# Altium schematic sheet EVK-NORA-W1_SCHEM_0005_Interface_Isolation.SchDoc
size B; Date: 7/24/2020; CompanyName: U-blox; DrawnBy: EMOO; Engineer: EMOO; Organization: U-blox; Address1: 3950 Fairview Industrial Dr SE #100*; Address2: Salem, OR 97302; SheetNumber: 4; SheetTotal: 6; SheetSize: B; SheetTitle: Interface MCU
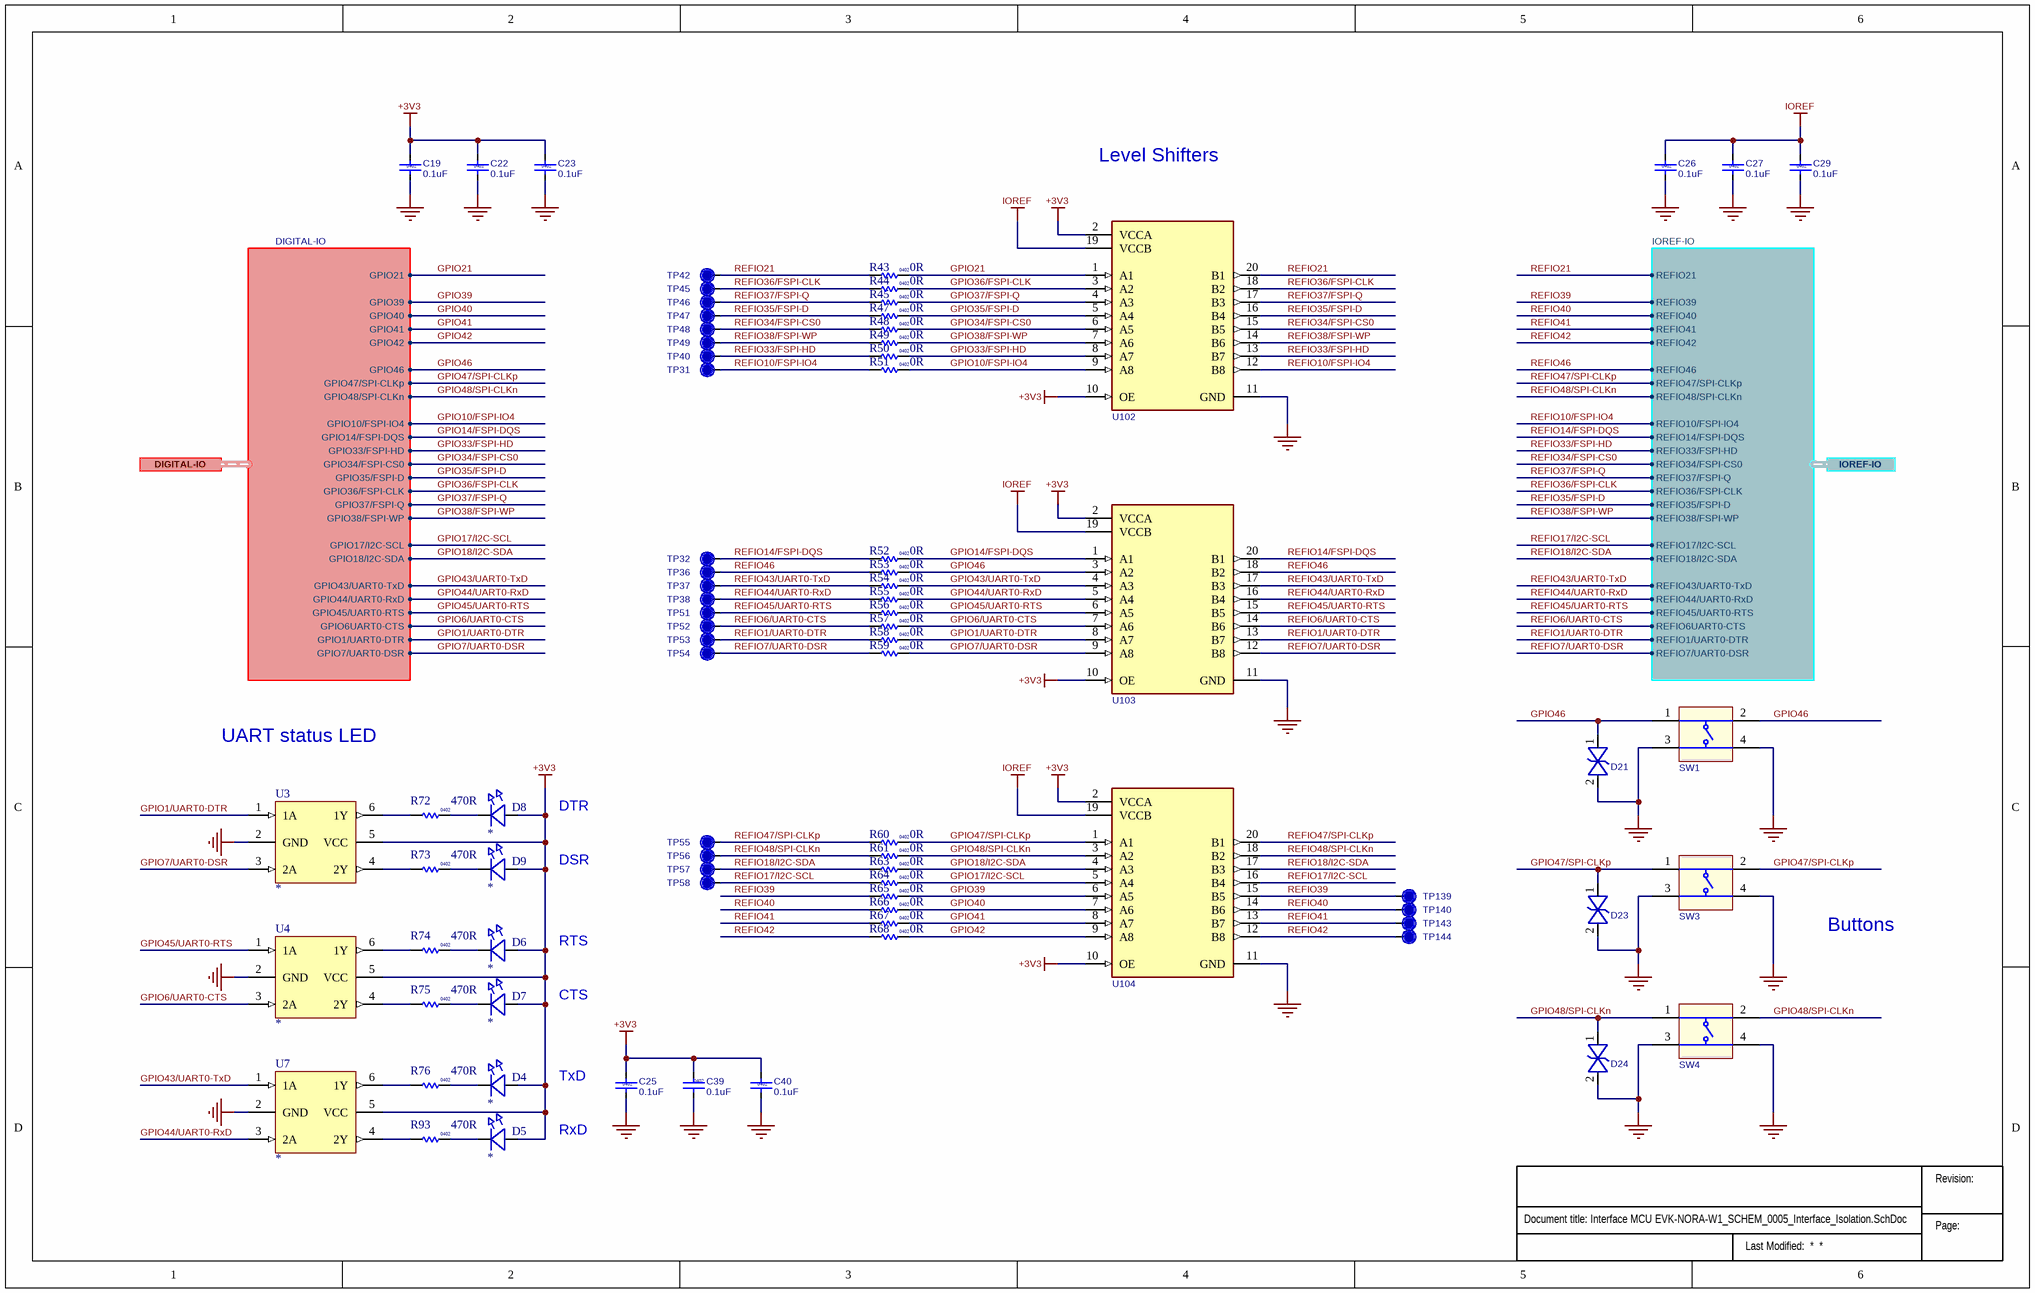
[diagram p0: EVK-NORA-W1_SCHEM_0005_Interface_Isolation.SchDoc]

## Parts
?  (no value)  (graphical)
C19  value 0.1uF  Size: 0402  [Cap 0402 HD]  (hidden comment: 120-000160.1uF)
C22  value 0.1uF  Size: 0402  [Cap 0402 HD]  (hidden comment: 120-000160.1uF)
C23  value 0.1uF  Size: 0402  [Cap 0402 HD]  (hidden comment: 120-000160.1uF)
C25  value 0.1uF  Size: 0402  [Cap 0402 HD]  (hidden comment: 120-000160.1uF)
C26  value 0.1uF  Size: 0402  [Cap 0402 HD]  (hidden comment: 120-000160.1uF)
C27  value 0.1uF  Size: 0402  [Cap 0402 HD]  (hidden comment: 120-000160.1uF)
C29  value 0.1uF  Size: 0402  [Cap 0402 HD]  (hidden comment: 120-000160.1uF)
C39  value 0.1uF  Size: 0402  [Cap 0402 HD]  (hidden comment: 120-000160.1uF)
C40  value 0.1uF  Size: 0402  [Cap 0402 HD]  (hidden comment: 120-000160.1uF)
D4  (no value)  [LED-0603]
D5  (no value)  [LED-0603]
D6  (no value)  [LED-0603]
D7  (no value)  [LED-0603]
D8  (no value)  [LED-0603]
D9  (no value)  [LED-0603]
D21  110-00019  [SOD-923]  (value not drawn)
D23  110-00019  [SOD-923]  (value not drawn)
D24  110-00019  [SOD-923]  (value not drawn)
R43  value 0R  Size: 0402  [RES 0402 HD]
R44  value 0R  Size: 0402  [RES 0402 HD]
R45  value 0R  Size: 0402  [RES 0402 HD]
R47  value 0R  Size: 0402  [RES 0402 HD]
R48  value 0R  Size: 0402  [RES 0402 HD]
R49  value 0R  Size: 0402  [RES 0402 HD]
R50  value 0R  Size: 0402  [RES 0402 HD]
R51  value 0R  Size: 0402  [RES 0402 HD]
R52  value 0R  Size: 0402  [RES 0402 HD]
R53  value 0R  Size: 0402  [RES 0402 HD]
R54  value 0R  Size: 0402  [RES 0402 HD]
R55  value 0R  Size: 0402  [RES 0402 HD]
R56  value 0R  Size: 0402  [RES 0402 HD]
R57  value 0R  Size: 0402  [RES 0402 HD]
R58  value 0R  Size: 0402  [RES 0402 HD]
R59  value 0R  Size: 0402  [RES 0402 HD]
R60  value 0R  Size: 0402  [RES 0402 HD]
R61  value 0R  Size: 0402  [RES 0402 HD]
R63  value 0R  Size: 0402  [RES 0402 HD]
R64  value 0R  Size: 0402  [RES 0402 HD]
R65  value 0R  Size: 0402  [RES 0402 HD]
R66  value 0R  Size: 0402  [RES 0402 HD]
R67  value 0R  Size: 0402  [RES 0402 HD]
R68  value 0R  Size: 0402  [RES 0402 HD]
R72  value 470R  Size: 0402  [RES 0402 HD]
R73  value 470R  Size: 0402  [RES 0402 HD]
R74  value 470R  Size: 0402  [RES 0402 HD]
R75  value 470R  Size: 0402  [RES 0402 HD]
R76  value 470R  Size: 0402  [RES 0402 HD]
R93  value 470R  Size: 0402  [RES 0402 HD]
SW1  (no value)  [SW_TACT_SMT_6mm]
SW3  (no value)  [SW_TACT_SMT_6mm]
SW4  (no value)  [SW_TACT_SMT_6mm]
TP31  TP  [TP10R]  (value not drawn)  (no BOM)
TP32  TP  [TP10R]  (value not drawn)  (no BOM)
TP36  TP  [TP10R]  (value not drawn)  (no BOM)
TP37  TP  [TP10R]  (value not drawn)  (no BOM)
TP38  TP  [TP10R]  (value not drawn)  (no BOM)
TP40  TP  [TP10R]  (value not drawn)  (no BOM)
TP42  TP  [TP10R]  (value not drawn)  (no BOM)
TP45  TP  [TP10R]  (value not drawn)  (no BOM)
TP46  TP  [TP10R]  (value not drawn)  (no BOM)
TP47  TP  [TP10R]  (value not drawn)  (no BOM)
TP48  TP  [TP10R]  (value not drawn)  (no BOM)
TP49  TP  [TP10R]  (value not drawn)  (no BOM)
TP51  TP  [TP10R]  (value not drawn)  (no BOM)
TP52  TP  [TP10R]  (value not drawn)  (no BOM)
TP53  TP  [TP10R]  (value not drawn)  (no BOM)
TP54  TP  [TP10R]  (value not drawn)  (no BOM)
TP55  TP  [TP10R]  (value not drawn)  (no BOM)
TP56  TP  [TP10R]  (value not drawn)  (no BOM)
TP57  TP  [TP10R]  (value not drawn)  (no BOM)
TP58  TP  [TP10R]  (value not drawn)  (no BOM)
TP139  TP  [TP10R]  (value not drawn)  (no BOM)
TP140  TP  [TP10R]  (value not drawn)  (no BOM)
TP143  TP  [TP10R]  (value not drawn)  (no BOM)
TP144  TP  [TP10R]  (value not drawn)  (no BOM)
U3  (no value)  [SC70-6]
U4  (no value)  [SC70-6]
U7  (no value)  [SC70-6]
U102  TXS0108EPWR  [TSSOP-20Pin-6.5x6.4]  (value not drawn)
U103  TXS0108EPWR  [TSSOP-20Pin-6.5x6.4]  (value not drawn)
U104  TXS0108EPWR  [TSSOP-20Pin-6.5x6.4]  (value not drawn)

## Ports
DIGITAL-IO (harness DIGITAL-IO), IOREF-IO (harness IOREF-IO)

## Harnesses
IOREF-IO: REFIO1/UART0-DTR, REFIO10/FSPI-IO4, REFIO14/FSPI-DQS, REFIO17/I2C-SCL, REFIO18/I2C-SDA, REFIO21, REFIO33/FSPI-HD, REFIO34/FSPI-CS0, REFIO37/FSPI-Q, REFIO36/FSPI-CLK, REFIO35/FSPI-D, REFIO38/FSPI-WP, REFIO39, REFIO40, REFIO41, REFIO42, REFIO43/UART0-TxD, REFIO44/UART0-RxD, REFIO45/UART0-RTS, REFIO46, REFIO47/SPI-CLKp, REFIO48/SPI-CLKn, REFIO6UART0-CTS, REFIO7/UART0-DSR
DIGITAL-IO: GPIO1/UART0-DTR, GPIO10/FSPI-IO4, GPIO14/FSPI-DQS, GPIO17/I2C-SCL, GPIO18/I2C-SDA, GPIO21, GPIO33/FSPI-HD, GPIO34/FSPI-CS0, GPIO35/FSPI-D, GPIO36/FSPI-CLK, GPIO37/FSPI-Q, GPIO38/FSPI-WP, GPIO39, GPIO40, GPIO41, GPIO42, GPIO43/UART0-TxD, GPIO44/UART0-RxD, GPIO45/UART0-RTS, GPIO46, GPIO47/SPI-CLKp, GPIO48/SPI-CLKn, GPIO6UART0-CTS, GPIO7/UART0-DSR

## Nets
+3V3: C19.1 C22.1 C23.1 C25.1 C39.1 C40.1 D4.2(A) D5.2(A) D6.2(A) D7.2(A) D8.2(A) D9.2(A) U3.5(VCC) U4.5(VCC) U7.5(VCC) U102.2(VCCA) U102.10(OE) U103.2(VCCA) U103.10(OE) U104.2(VCCA) U104.10(OE)
GND: C19.2 C22.2 C23.2 C25.2 C26.2 C27.2 C29.2 C39.2 C40.2 D21.2 D23.2 D24.2 SW1.3 SW1.4 SW3.3 SW3.4 SW4.3 SW4.4 U3.2(GND) U4.2(GND) U7.2(GND) U102.11(GND) U103.11(GND) U104.11(GND)
IOREF: C26.1 C27.1 C29.1 U102.19(VCCB) U103.19(VCCB) U104.19(VCCB)
GPIO1/UART0-DTR: R58.2 U3.1(1A) U103.8(A7) ; port DIGITAL-IO.GPIO1/UART0-DTR
GPIO6/UART0-CTS: R57.2 U4.3(2A) U103.7(A6) ; port DIGITAL-IO.GPIO6UART0-CTS
GPIO7/UART0-DSR: R59.2 U3.3(2A) U103.9(A8) ; port DIGITAL-IO.GPIO7/UART0-DSR
GPIO10/FSPI-IO4: R51.2 U102.9(A8) ; port DIGITAL-IO.GPIO10/FSPI-IO4
GPIO14/FSPI-DQS: R52.2 U103.1(A1) ; port DIGITAL-IO.GPIO14/FSPI-DQS
GPIO17/I2C-SCL: R64.2 U104.5(A4) ; port DIGITAL-IO.GPIO17/I2C-SCL
GPIO18/I2C-SDA: R63.2 U104.4(A3) ; port DIGITAL-IO.GPIO18/I2C-SDA
GPIO21: R43.2 U102.1(A1) ; port DIGITAL-IO.GPIO21
GPIO33/FSPI-HD: R50.2 U102.8(A7) ; port DIGITAL-IO.GPIO33/FSPI-HD
GPIO34/FSPI-CS0: R48.2 U102.6(A5) ; port DIGITAL-IO.GPIO34/FSPI-CS0
GPIO35/FSPI-D: R47.2 U102.5(A4) ; port DIGITAL-IO.GPIO35/FSPI-D
GPIO36/FSPI-CLK: R44.2 U102.3(A2) ; port DIGITAL-IO.GPIO36/FSPI-CLK
GPIO37/FSPI-Q: R45.2 U102.4(A3) ; port DIGITAL-IO.GPIO37/FSPI-Q
GPIO38/FSPI-WP: R49.2 U102.7(A6) ; port DIGITAL-IO.GPIO38/FSPI-WP
GPIO39: R65.2 U104.6(A5) ; port DIGITAL-IO.GPIO39
GPIO40: R66.2 U104.7(A6) ; port DIGITAL-IO.GPIO40
GPIO41: R67.2 U104.8(A7) ; port DIGITAL-IO.GPIO41
GPIO42: R68.2 U104.9(A8) ; port DIGITAL-IO.GPIO42
GPIO43/UART0-TxD: R54.2 U7.1(1A) U103.4(A3) ; port DIGITAL-IO.GPIO43/UART0-TxD
GPIO44/UART0-RxD: R55.2 U7.3(2A) U103.5(A4) ; port DIGITAL-IO.GPIO44/UART0-RxD
GPIO45/UART0-RTS: R56.2 U4.1(1A) U103.6(A5) ; port DIGITAL-IO.GPIO45/UART0-RTS
GPIO46: D21.1 R53.2 SW1.1 SW1.2 U103.3(A2) ; port DIGITAL-IO.GPIO46
GPIO47/SPI-CLKp: D23.1 R60.2 SW3.1 SW3.2 U104.1(A1) ; port DIGITAL-IO.GPIO47/SPI-CLKp
GPIO48/SPI-CLKn: D24.1 R61.2 SW4.1 SW4.2 U104.3(A2) ; port DIGITAL-IO.GPIO48/SPI-CLKn
REFIO1/UART0-DTR: R58.1 TP53.1 U103.13(B7) ; port IOREF-IO.REFIO1/UART0-DTR
REFIO6/UART0-CTS: R57.1 TP52.1 U103.14(B6) ; port IOREF-IO.REFIO6UART0-CTS
REFIO7/UART0-DSR: R59.1 TP54.1 U103.12(B8) ; port IOREF-IO.REFIO7/UART0-DSR
REFIO10/FSPI-IO4: R51.1 TP31.1 U102.12(B8) ; port IOREF-IO.REFIO10/FSPI-IO4
REFIO14/FSPI-DQS: R52.1 TP32.1 U103.20(B1) ; port IOREF-IO.REFIO14/FSPI-DQS
REFIO17/I2C-SCL: R64.1 TP58.1 U104.16(B4) ; port IOREF-IO.REFIO17/I2C-SCL
REFIO18/I2C-SDA: R63.1 TP57.1 U104.17(B3) ; port IOREF-IO.REFIO18/I2C-SDA
REFIO21: R43.1 TP42.1 U102.20(B1) ; port IOREF-IO.REFIO21
REFIO33/FSPI-HD: R50.1 TP40.1 U102.13(B7) ; port IOREF-IO.REFIO33/FSPI-HD
REFIO34/FSPI-CS0: R48.1 TP48.1 U102.15(B5) ; port IOREF-IO.REFIO34/FSPI-CS0
REFIO35/FSPI-D: R47.1 TP47.1 U102.16(B4) ; port IOREF-IO.REFIO35/FSPI-D
REFIO36/FSPI-CLK: R44.1 TP45.1 U102.18(B2) ; port IOREF-IO.REFIO36/FSPI-CLK
REFIO37/FSPI-Q: R45.1 TP46.1 U102.17(B3) ; port IOREF-IO.REFIO37/FSPI-Q
REFIO38/FSPI-WP: R49.1 TP49.1 U102.14(B6) ; port IOREF-IO.REFIO38/FSPI-WP
REFIO39: R65.1 TP139.1 U104.15(B5) ; port IOREF-IO.REFIO39
REFIO40: R66.1 TP140.1 U104.14(B6) ; port IOREF-IO.REFIO40
REFIO41: R67.1 TP143.1 U104.13(B7) ; port IOREF-IO.REFIO41
REFIO42: R68.1 TP144.1 U104.12(B8) ; port IOREF-IO.REFIO42
REFIO43/UART0-TxD: R54.1 TP37.1 U103.17(B3) ; port IOREF-IO.REFIO43/UART0-TxD
REFIO44/UART0-RxD: R55.1 TP38.1 U103.16(B4) ; port IOREF-IO.REFIO44/UART0-RxD
REFIO45/UART0-RTS: R56.1 TP51.1 U103.15(B5) ; port IOREF-IO.REFIO45/UART0-RTS
REFIO46: R53.1 TP36.1 U103.18(B2) ; port IOREF-IO.REFIO46
REFIO47/SPI-CLKp: R60.1 TP55.1 U104.20(B1) ; port IOREF-IO.REFIO47/SPI-CLKp
REFIO48/SPI-CLKn: R61.1 TP56.1 U104.18(B2) ; port IOREF-IO.REFIO48/SPI-CLKn
NetD4_1: D4.1(C) R76.2
NetD5_1: D5.1(C) R93.2
NetD6_1: D6.1(C) R74.2
NetD7_1: D7.1(C) R75.2
NetD8_1: D8.1(C) R72.2
NetD9_1: D9.1(C) R73.2
NetR72_1: R72.1 U3.6(1Y)
NetR73_1: R73.1 U3.4(2Y)
NetR74_1: R74.1 U4.6(1Y)
NetR75_1: R75.1 U4.4(2Y)
NetR76_1: R76.1 U7.6(1Y)
NetR93_1: R93.1 U7.4(2Y)

## Notes on the sheet
- Level Shifters
- UART status LED
- DTR
- DSR
- RTS
- Buttons
- CTS
- TxD
- RxD
- Revision:
- Page:

## Library data of the parts
? = Sub_Title_Block: Minimized schematic title block for all subset sheets
C19 C22 C23 C25-C27 C29 C39 C40 = 120-00016: Cap, Ceramic 0.1uF 10V 10% X5R 0402; Part Name: CAP CER 0.1UF 10V 10% X5R 0402; Part_Type: Ceramic Capacitor; Manufacturer: Murata Electronics North America; Manufacturer P/N: GRM155R61A104KA01J; Item_Phase: Production; Component Mounting Type: SMT; Tolerance: +/- 10%; Use in new designs: Yes; Part Number: 120-00016; Revision: 0A; Supplier 1: Digi-Key; Supplier Part Number 1: 490-6297-1-ND; Manufacturer 2: Yageo; Manufacturer P/N 2: CC0402KRX5R6BB104; Supplier 2: Digi-Key; Supplier Part Number 2: 311-1336-1-ND; Arena Link: https://app.bom.com/a/GYHPV2L2L43KRMBK?v=spec.summary; Height: 0.55mm; Pins: 2; Temperature Coefficient: X5R; Voltage: 10V
D4-D9 = UBXH11-0000018: LED CHIP 0603 LOW CURRENT OSRAM 0.002A GREEN 2.2V 2mA; Manufacturer P/N: LG L29K-G2J1-24; Editor: johann.furrer; Released by: martin.grasse; Env: ROHS; Permitted Use: Volume Products; Perferred: PREF; Mfg P/N Status: Active; Mfg P/N Split: 100; Mfg P/N Released: Yes; Color: *; Part Number: UBXH11-0000018; Value: GREEN; Max Voltage: 2.2V; Max Current: 2mA; Size: 0603; Min Operating Temp: -40°C; Max Operating Temp: 85°C; Part Type: LED; Release Data: 2018-01-09 15:31:38.754561; UBX Wiki: https://wiki.u-blox.com/bin/view/Operations/PartDetails?index=20619; RefDes: DS; Manufacturer: Osram; Mfg P/N Datasheet: https://wiki.u-blox.com/bin/view/Generic/Docs/DocumentSummary?index=20620
D21 D23 D24 = 110-00019: ESD9B3.3ST5G; Part Name: Diode TVS 3.3V SOD-923; Part_Type: Diode; Manufacturer: ON Semiconductor; Item_Phase: Preliminary; Body Size: 0.8mm x 0.6mm; Component Mounting Type: SMT; Diode Type: TVS; Use in new designs: Yes; Voltage: 3.3V; Part Number: 110-00019; Manufacturer P/N: ESD9B3.3ST5G; Supplier 1: Digi-Key; Supplier Part Number 1: ESD9B3.3ST5GOSCT-ND; Arena Link: https://app.bom.com/a/4M5DJQ9Q9SR7DV4H?v=spec.summary; Height: 0.4mm; MFG Package: SOD-923; Package Type: SOD; Pins: 2
R43-R45 R47-R61 R63-R68 = UBXH18-0003002: RES THICK FILM CHIP 0402 0R 0 100mW; Manufacturer: KOA; Manufacturer P/N: RK73Z1ETTD; Tolerance: 0; Editor: charlotte.biber; Released by: peter.mueller; Env: ROHS; Permitted Use: Volume Products; Perferred: PREF; Mfg P/N Status: NRND; Mfg P/N Split: 100; Mfg P/N Released: Yes; Part Number: UBXH18-0003002; Max Power: 100mW; Part Type: Resistor; Release Data: 2012-06-05 09:49:55.978616; UBX Wiki: https://wiki.u-blox.com/bin/view/Operations/PartDetails?index=6611; RefDes: R; Manufacturer 2: YAGEO; Manufacturer P/N 2: 2322_705_91001_L; Mfg P/N Status 2: NRND; Mfg P/N Split 2: 0; Mfg P/N Released 2: Yes
R72-R76 R93 = UBXH18-0008041: RES THICK FILM CHIP 0402 470R 5% 100mW; Manufacturer: ROHM; Manufacturer P/N: MCR01MZPJ471; Editor: roland.rust; Env: ROHS; Permitted Use: Volume Products; Perferred: PREF; Mfg P/N Status: Active; Mfg P/N Split: 100; Mfg P/N Released: Yes; Part Number: UBXH18-0008041; Tolerance: 5%; Max Power: 100mW; Part Type: Resistor; Released by: roland.rust; Release Data: 2009-04-24 14:36:39; UBX Wiki: https://wiki.u-blox.com/bin/view/Operations/PartDetails?index=6926; RefDes: R; Manufacturer 2: KOA; Manufacturer P/N 2: RK73B1ETTP471J; Mfg P/N Status 2: Active; Mfg P/N Split 2: 0; Mfg P/N Released 2: Yes; Manufacturer 3: YAGEO; Manufacturer P/N 3: 2322_705_87471_L; Mfg P/N Status 3: NRND; Mfg P/N Split 3: 0; Mfg P/N Released 3: Yes
SW1 SW3 SW4 = 135-00002: Tactile Switch, SPST-NO, SMT, Actuation force = 160g, 6mm x 6mm; Part Name: Button Tactile SPST-NO 50mA 6mm SMT; Part_Type: Button; Manufacturer: C&K Components; Manufacturer P/N: PTS645SM43SMTR92 LFS; Item_Phase: Production; Current: 50mA; Switch/Button Circuit: SPST; Switch/Button Function: Off-Mom; Use in new designs: Yes; Voltage: 12VDC; Part Number: 135-00002; Supplier 1: Digi-Key; Supplier Part Number 1: CKN9112CT-ND; Arena Link: https://app.bom.com/a/L3MU07Q7Q98QQQW6?v=spec.summary; Body Size: 6mm x 6mm; Component Mounting Type: SMT; Height: 4.4mm; Pins: 4; Revision: 0B; Manufacturer 2: Seeed Technology; Manufacturer P/N 2: Rigado 135-00002; Supplier 2: Seeed Technology; Supplier Part Number 2: Rigado 135-00002
TP31 TP32 TP36-TP38 TP40 TP42 TP45-TP49 TP51-TP58 TP139 TP140 TP143 TP144 = TP10R: Testpoint, Round 1.0mm Dia; Added By: Jeremy D; Part Number: TP10R; Size: 1.0mm; Height: 0; DNP: DNP; Added Date: 2/1/2015; Checked By: Paul B; Checked Date: 2/5/2015
U3 U4 U7 = 225-00022: Buffer, Non-Inverting 2 Element 1 Bit per Element Push-Pull Output SC-70-6; Manufacturer 1: Texas Instruments; Manufacturer Part Number 1: SN74LVC2G34DCKR; Part Name: IC BUF NON-INVERT 5.5V SC70-6; Body Size: 1.25mm x 2mm; Item Phase: In Production; SMT Pitch: 0.65mm; Thermal Pad: No; Use in new designs: Yes; Voltage: 5.5V; UBX Code: None; Manufacturer P/N: *; Part Number: 225-00022; Supplier 1: Digi-Key; Supplier Part Number 1: 296-13497-1-ND; Height: 1.1mm; Logic Type: Buffer; MFG Package: SC-70-6; Max Operating Temp: 125; Min Operating Temp: -40; Pins: 6; Revision: 0A; Manufacturer 2: ON Semiconductor; Manufacturer Part Number 2: NC7WZ16P6X; Supplier 2: Digi-Key; Supplier Part Number 2: NC7WZ16P6XCT-ND
U102-U104 = UBXH10-0000036: TXS0108 8-BIT BIDIRECTIONAL VOLTAGE-LEVEL TRANSLATOR; Manufacturer: Texas Instruments; Editor: roland.rust; Released by: adam.johansson; Env: GREEN; Permitted Use: Support Products; Perferred: PREF; Mfg P/N Status: Active; Mfg P/N Split: 100; Mfg P/N Released: Yes; Part Number: UBXH10-0000036; Value: TXS0108EPWR; Min Operating Temp: -40°C; Max Operating Temp: 85°C; Part Type: Interface; Release Data: 2015-06-17T17:08:49; UBX Wiki: https://wiki.u-blox.com/bin/view/Operations/PartDetails?index=22749; RefDes: U; Manufacturer P/N: TXS0108EPWR; Mfg P/N Datasheet: https://wiki.u-blox.com/bin/view/Generic/Docs/DocumentSummary?index=22748